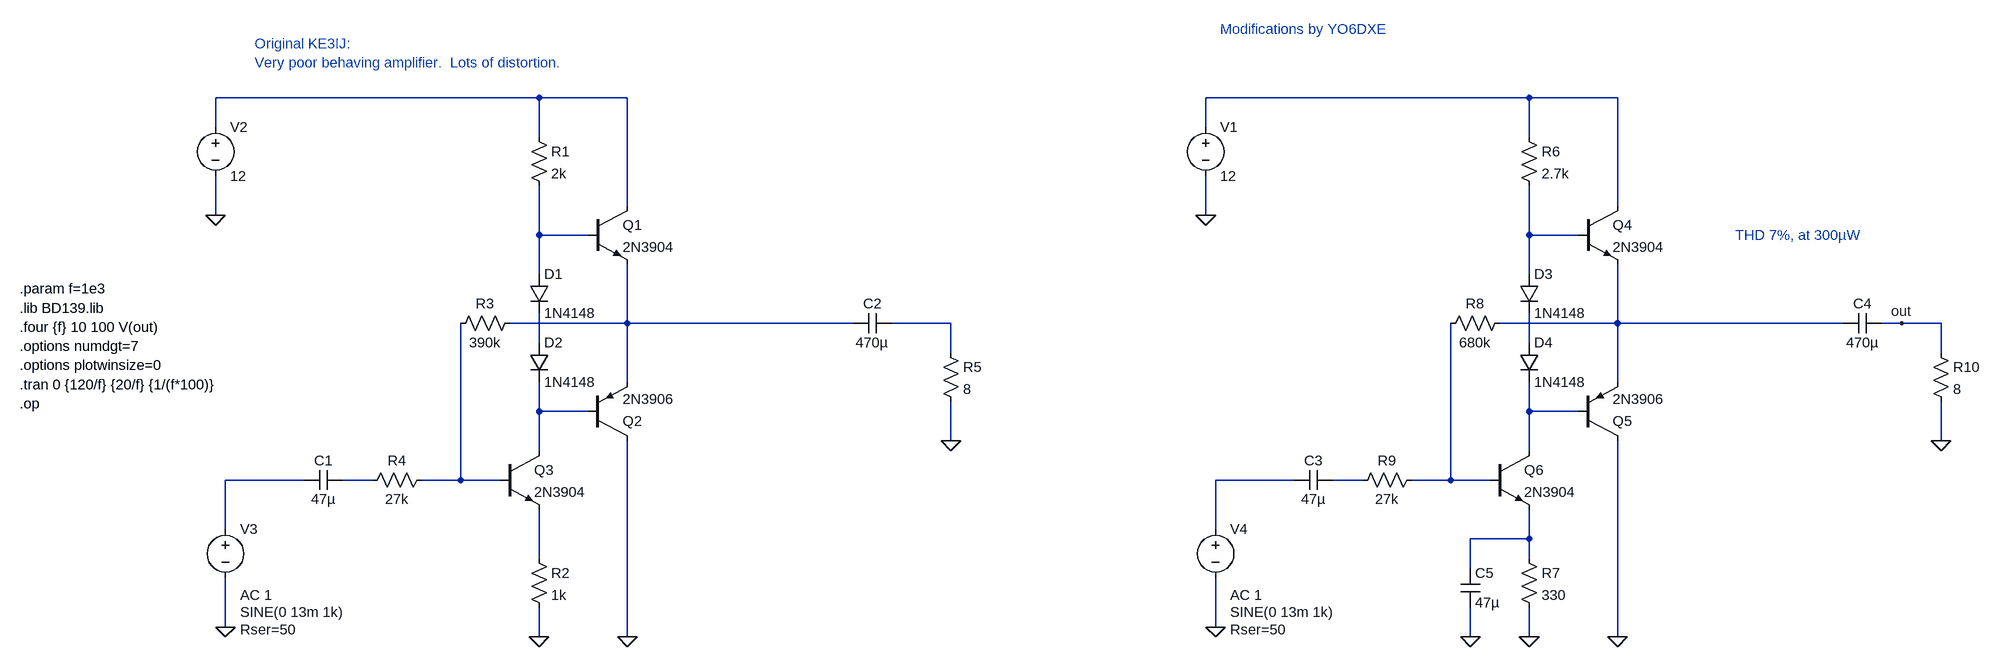
[diagram p0: schematic KE3IJ.asc]
KE3IJ.asc, the LTspice schematic file:
Version 4
SHEET 1 2544 744
WIRE 80 -176 -448 -176
WIRE 224 -176 80 -176
WIRE 1696 -176 1168 -176
WIRE 1840 -176 1696 -176
WIRE -448 -128 -448 -176
WIRE 1168 -128 1168 -176
WIRE 80 -112 80 -176
WIRE 1696 -112 1696 -176
WIRE 224 0 224 -176
WIRE 1840 0 1840 -176
WIRE -448 16 -448 -48
WIRE 1168 16 1168 -48
WIRE 80 48 80 -32
WIRE 160 48 80 48
WIRE 1696 48 1696 -32
WIRE 1776 48 1696 48
WIRE 80 112 80 48
WIRE 1696 112 1696 48
WIRE 224 192 224 96
WIRE 224 192 32 192
WIRE 592 192 224 192
WIRE 752 192 656 192
WIRE 1840 192 1840 96
WIRE 1840 192 1648 192
WIRE 2208 192 1840 192
WIRE 2304 192 2272 192
WIRE 2368 192 2304 192
WIRE 80 224 80 176
WIRE 1696 224 1696 176
WIRE 752 240 752 192
WIRE 2368 240 2368 192
WIRE 224 288 224 192
WIRE 1840 288 1840 192
WIRE 80 336 80 288
WIRE 160 336 80 336
WIRE 1696 336 1696 288
WIRE 1776 336 1696 336
WIRE 752 384 752 320
WIRE 2368 384 2368 320
WIRE 80 400 80 336
WIRE 1696 400 1696 336
WIRE -304 448 -432 448
WIRE -192 448 -240 448
WIRE -48 448 -48 192
WIRE -48 448 -112 448
WIRE 16 448 -48 448
WIRE 1312 448 1184 448
WIRE 1424 448 1376 448
WIRE 1568 448 1568 192
WIRE 1568 448 1504 448
WIRE 1632 448 1568 448
WIRE -432 528 -432 448
WIRE 1184 528 1184 448
WIRE 1696 544 1696 496
WIRE 1696 544 1600 544
WIRE 80 576 80 496
WIRE 1696 576 1696 544
WIRE 1600 592 1600 544
WIRE -432 688 -432 608
WIRE 1184 688 1184 608
WIRE 80 704 80 656
WIRE 224 704 224 384
WIRE 1600 704 1600 656
WIRE 1696 704 1696 656
WIRE 1840 704 1840 384
FLAG -448 16 0
FLAG -432 688 0
FLAG 80 704 0
FLAG 224 704 0
FLAG 752 384 0
FLAG 1168 16 0
FLAG 1184 688 0
FLAG 1696 704 0
FLAG 1840 704 0
FLAG 2368 384 0
FLAG 2304 192 out
FLAG 1600 704 0
DATAFLAG 480 192 ""
DATAFLAG 2096 192 ""
SYMBOL npn 160 0 R0
SYMATTR InstName Q1
SYMATTR Value 2N3904
SYMBOL pnp 160 384 M180
SYMATTR InstName Q2
SYMATTR Value 2N3906
SYMBOL diode 64 112 R0
SYMATTR InstName D1
SYMATTR Value 1N4148
SYMBOL diode 64 224 R0
SYMATTR InstName D2
SYMATTR Value 1N4148
SYMBOL res 64 -128 R0
SYMATTR InstName R1
SYMATTR Value 2k
SYMBOL npn 16 400 R0
SYMATTR InstName Q3
SYMATTR Value 2N3904
SYMBOL res 64 560 R0
SYMATTR InstName R2
SYMATTR Value 1k
SYMBOL res 48 176 R90
WINDOW 0 0 56 VBottom 2
WINDOW 3 32 56 VTop 2
SYMATTR InstName R3
SYMATTR Value 390k
SYMBOL res -96 432 R90
WINDOW 0 0 56 VBottom 2
WINDOW 3 32 56 VTop 2
SYMATTR InstName R4
SYMATTR Value 27k
SYMBOL cap -240 432 R90
WINDOW 0 0 32 VBottom 2
WINDOW 3 32 32 VTop 2
SYMATTR InstName C1
SYMATTR Value 47µ
SYMBOL voltage -448 -144 R0
SYMATTR InstName V2
SYMATTR Value 12
SYMBOL cap 656 176 R90
WINDOW 0 0 32 VBottom 2
WINDOW 3 32 32 VTop 2
SYMATTR InstName C2
SYMATTR Value 470µ
SYMBOL res 736 224 R0
SYMATTR InstName R5
SYMATTR Value 8
SYMBOL voltage -432 512 R0
WINDOW 3 24 152 Left 2
WINDOW 123 24 124 Left 2
WINDOW 39 24 180 Left 2
SYMATTR Value SINE(0 13m 1k)
SYMATTR Value2 AC 1
SYMATTR SpiceLine Rser=50
SYMATTR InstName V3
SYMBOL npn 1776 0 R0
SYMATTR InstName Q4
SYMATTR Value 2N3904
SYMBOL pnp 1776 384 M180
SYMATTR InstName Q5
SYMATTR Value 2N3906
SYMBOL diode 1680 112 R0
SYMATTR InstName D3
SYMATTR Value 1N4148
SYMBOL diode 1680 224 R0
SYMATTR InstName D4
SYMATTR Value 1N4148
SYMBOL res 1680 -128 R0
SYMATTR InstName R6
SYMATTR Value 2.7k
SYMBOL npn 1632 400 R0
SYMATTR InstName Q6
SYMATTR Value 2N3904
SYMBOL res 1680 560 R0
SYMATTR InstName R7
SYMATTR Value 330
SYMBOL res 1664 176 R90
WINDOW 0 0 56 VBottom 2
WINDOW 3 32 56 VTop 2
SYMATTR InstName R8
SYMATTR Value 680k
SYMBOL res 1520 432 R90
WINDOW 0 0 56 VBottom 2
WINDOW 3 32 56 VTop 2
SYMATTR InstName R9
SYMATTR Value 27k
SYMBOL cap 1376 432 R90
WINDOW 0 0 32 VBottom 2
WINDOW 3 32 32 VTop 2
SYMATTR InstName C3
SYMATTR Value 47µ
SYMBOL voltage 1168 -144 R0
SYMATTR InstName V1
SYMATTR Value 12
SYMBOL cap 2272 176 R90
WINDOW 0 0 32 VBottom 2
WINDOW 3 32 32 VTop 2
SYMATTR InstName C4
SYMATTR Value 470µ
SYMBOL res 2352 224 R0
SYMATTR InstName R10
SYMATTR Value 8
SYMBOL voltage 1184 512 R0
WINDOW 3 24 152 Left 2
WINDOW 123 24 124 Left 2
WINDOW 39 24 180 Left 2
SYMATTR Value SINE(0 13m 1k)
SYMATTR Value2 AC 1
SYMATTR SpiceLine Rser=50
SYMATTR InstName V4
SYMBOL cap 1584 592 R0
SYMATTR InstName C5
SYMATTR Value 47µ
TEXT -768 136 Left 2 !.param f=1e3\n.lib BD139.lib\n.four {f} 10 100 V(out)\n.options numdgt=7\n.options plotwinsize=0\n.tran 0 {120/f} {20/f} {1/(f*100)}\n.op
TEXT -384 -264 Left 2 ;Original KE3IJ:\nVery poor behaving amplifier.  Lots of distortion.
TEXT 1192 -288 Left 2 ;Modifications by YO6DXE
TEXT 2032 48 Left 2 ;THD 7%, at 300µW

The netlist it stands for:
* KE3IJ.asc
Q1 N001 N003 N005 0 2N3904
Q2 0 N010 N005 0 2N3906
D1 N003 N008 1N4148
D2 N008 N010 1N4148
R1 N001 N003 2k
Q3 N010 N014 N019 0 2N3904
R2 N019 0 1k
R3 N005 N014 390k
R4 N014 N013 27k
C1 N013 N012 47µ
V2 N001 0 12
C2 N006 N005 470µ
R5 N006 0 8
V3 N012 0 SINE(0 13m 1k) AC 1 Rser=50
Q4 N002 N004 N007 0 2N3904
Q5 0 N011 N007 0 2N3906
D3 N004 N009 1N4148
D4 N009 N011 1N4148
R6 N002 N004 2.7k
Q6 N011 N017 N018 0 2N3904
R7 N018 0 330
R8 N007 N017 680k
R9 N017 N016 27k
C3 N016 N015 47µ
V1 N002 0 12
C4 out N007 470µ
R10 out 0 8
V4 N015 0 SINE(0 13m 1k) AC 1 Rser=50
C5 N018 0 47µ
.model D D
.lib standard.dio
.model NPN NPN
.model PNP PNP
.lib standard.bjt
.param f=1e3
.lib BD139.lib
.four {f} 10 100 V(out)
.options numdgt=7
.options plotwinsize=0
.tran 0 {120/f} {20/f} {1/(f*100)}
.op
* Original KE3IJ:
* Very poor behaving amplifier.  Lots of distortion.
* Modifications by YO6DXE
* THD 7%, at 300µW
.backanno
.end